# Altium project OnkoV1.PrjPCB
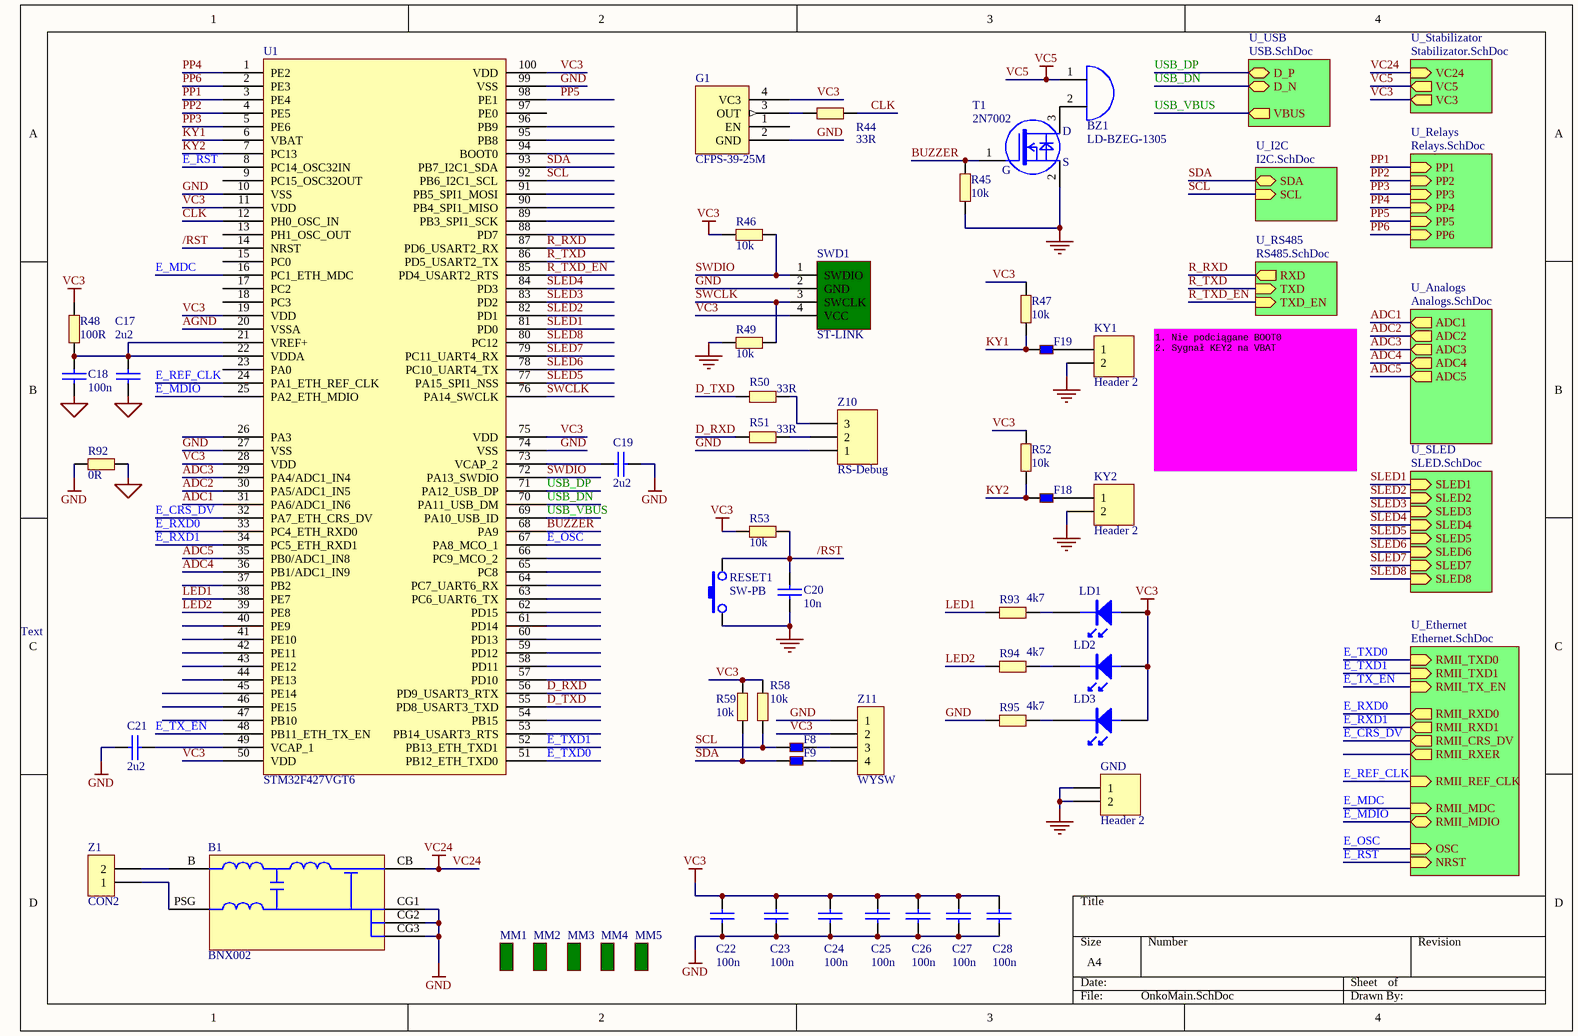
[diagram p0: OnkoMain.SchDoc]
9 sheets, 231 parts. Net scope: hierarchical (ports join the sheet entries above them; power ports are global).
Board file: OnkoV1.PcbDoc
Sheets:
  OnkoMain.SchDoc
    U_Analogs = Analogs.SchDoc
    U_Stabilizator = Stabilizator.SchDoc
    U_Relays = Relays.SchDoc
    U_Ethernet = Ethernet.SchDoc
    U_USB = USB.SchDoc
    U_I2C = I2C.SchDoc
    U_SLED = SLED.SchDoc
    U_RS485 = RS485.SchDoc

## Sheet OnkoMain.SchDoc
size A4

### Parts
B1  BNX002  [BNX002]
BZ1  LD-BZEG-1305  [LD-BZEG-1305]
C17  2u2  [0805C]
C18  100n  [0805C]
C19  2u2  [0805C]
C20  10n  [0805C]
C21  2u2  [0805C]
C22  100n  [0805C]
C23  100n  [0805C]
C24  100n  [0805C]
C25  100n  [0805C]
C26  100n  [0805C]
C27  100n  [0805C]
C28  100n  [0805C]
F8  BLM18BB141SN1D  [0805L]  (value not drawn)
F9  BLM18BB141SN1D  [0805L]  (value not drawn)
F18  BLM18BB141SN1D  [0805L]  (value not drawn)
F19  BLM18BB141SN1D  [0805L]  (value not drawn)
G1  CFPS-39-25M  [GEN_SMD1_1]
GND  Header 2  [HDR1X2]
KY1  Header 2  [HDR1X2]
KY2  Header 2  [HDR1X2]
LD1  (no value)  [0805LG]
LD2  (no value)  [0805LR]
LD3  (no value)  [0805LG]
MM1  (no value)  [REF_CIR]
MM2  (no value)  [REF_CIR]
MM3  (no value)  [REF_SQR]
MM4  (no value)  [REF_SQR]
MM5  (no value)  [PB_FREE_GRAF]
R44  33R  [0805R]
R45  10k  [0805]
R46  10k  [0805R]
R47  10k  [0805R]
R48  100R  [0805]
R49  10k  [0805R]
R50  33R  [0805R]
R51  33R  [0805R]
R52  10k  [0805R]
R53  10k  [0805R]
R58  10k  [0805R]
R59  10k  [0805R]
R92  0R  [0805]
R93  4k7  [0805R]
R94  4k7  [0805R]
R95  4k7  [0805R]
RESET1  SW-PB  [DTSM31N_2]
SWD1  ST-LINK  [PIN4]
T1  2N7002  [SOT23]
U1  STM32F427VGT6  [VQ100_2]
Z1  CON2  [ARC-L-2-5.08]
Z10  RS-Debug  [PIN3]
Z11  WYSW  [PIN4]

### Sub-sheets
U_Analogs = Analogs.SchDoc: ADC1 (out), ADC2 (out), ADC3 (out), ADC4 (out), ADC5 (out)
U_Ethernet = Ethernet.SchDoc: RMII_TXD0 (in), RMII_TX_EN (in), RMII_RXD0 (out), RMII_REF_CLK (in), RMII_CRS_DV (out), RMII_MDC (in), RMII_MDIO (bidir), NRST (in), RMII_TXD1 (in), RMII_RXD1 (out), RMII_RXER (out), OSC (in)
U_I2C = I2C.SchDoc: SCL (in), SDA (bidir)
U_Relays = Relays.SchDoc: PP1 (in), PP2 (in), PP3 (in), PP4 (in), PP5 (in), PP6 (in)
U_RS485 = RS485.SchDoc: TXD (in), TXD_EN (in), RXD (out)
U_SLED = SLED.SchDoc: SLED1 (in), SLED2 (in), SLED3 (in), SLED4 (in), SLED5 (in), SLED6 (in), SLED7 (in), SLED8 (in)
U_Stabilizator = Stabilizator.SchDoc: VC5 (out), VC3 (out), VC24 (in)
U_USB = USB.SchDoc: D_N (bidir), D_P (bidir), VBUS (out)

### Nets
AGND: C17.2 C18.2 R92.1 U1.20(VSSA)
GND: B1.CG1 B1.CG2 B1.CG3 C19.1 C20.2 C21.1 C22.2 C23.2 C24.2 C25.2 C26.2 C27.2 C28.2 G1.2(GND) GND.1 GND.2 KY1.2 KY2.2 R45.2 R49.1 R92.2 R95.2 RESET1.1 SWD1.2(GND) T1.2(S) U1.10(VSS) U1.27(VSS) U1.74(VSS) U1.99(VSS) Z10.1 Z11.1
VC3: C22.1 C23.1 C24.1 C25.1 C26.1 C27.1 C28.1 G1.4(VC3) LD1.A LD2.A LD3.A R46.1 R47.2 R48.2 R52.2 R53.1 R58.2 R59.2 SWD1.4(VCC) U1.11(VDD) U1.19(VDD) U1.28(VDD) U1.50(VDD) U1.75(VDD) U1.100(VDD) Z11.2 ; sheet U_Stabilizator/VC3
VC5: BZ1.1 ; sheet U_Stabilizator/VC5
VC24: B1.CB ; sheet U_Stabilizator/VC24
/RST: C20.1 R53.2 RESET1.2 U1.14(NRST)
ADC1: U1.31(PA6/ADC1_IN6) ; sheet U_Analogs/ADC1
ADC2: U1.30(PA5/ADC1_IN5) ; sheet U_Analogs/ADC2
ADC3: U1.29(PA4/ADC1_IN4) ; sheet U_Analogs/ADC3
ADC4: U1.36(PB1/ADC1_IN9) ; sheet U_Analogs/ADC4
ADC5: U1.35(PB0/ADC1_IN8) ; sheet U_Analogs/ADC5
BUZZER: R45.1 T1.1 U1.68(PA9)
CLK: R44.2 U1.12(PH0_OSC_IN)
D_RXD: R51.2 U1.56(PD9_USART3_RTX)
D_TXD: R50.2 U1.55(PD8_USART3_TXD)
E_CRS_DV: U1.32(PA7_ETH_CRS_DV) ; sheet U_Ethernet/RMII_CRS_DV
E_MDC: U1.16(PC1_ETH_MDC) ; sheet U_Ethernet/RMII_MDC
E_MDIO: U1.25(PA2_ETH_MDIO) ; sheet U_Ethernet/RMII_MDIO
E_OSC: U1.67(PA8_MCO_1) ; sheet U_Ethernet/OSC
E_REF_CLK: U1.24(PA1_ETH_REF_CLK) ; sheet U_Ethernet/RMII_REF_CLK
E_RST: U1.8(PC14_OSC32IN) ; sheet U_Ethernet/NRST
E_RXD0: U1.33(PC4_ETH_RXD0) ; sheet U_Ethernet/RMII_RXD0
E_RXD1: U1.34(PC5_ETH_RXD1) ; sheet U_Ethernet/RMII_RXD1
E_TX_EN: U1.48(PB11_ETH_TX_EN) ; sheet U_Ethernet/RMII_TX_EN
E_TXD0: U1.51(PB12_ETH_TXD0) ; sheet U_Ethernet/RMII_TXD0
E_TXD1: U1.52(PB13_ETH_TXD1) ; sheet U_Ethernet/RMII_TXD1
KY1: F19.2 R47.1 U1.6(VBAT)
KY2: F18.2 R52.1 U1.7(PC13)
LED1: R93.2 U1.38(PE7)
LED2: R94.2 U1.39(PE8)
PP1: U1.3(PE4) ; sheet U_Relays/PP1
PP2: U1.4(PE5) ; sheet U_Relays/PP2
PP3: U1.5(PE6) ; sheet U_Relays/PP3
PP4: U1.1(PE2) ; sheet U_Relays/PP4
PP5: U1.98(PE1) ; sheet U_Relays/PP5
PP6: U1.2(PE3) ; sheet U_Relays/PP6
R_RXD: U1.87(PD6_USART2_RX) ; sheet U_RS485/RXD
R_TXD: U1.86(PD5_USART2_TX) ; sheet U_RS485/TXD
R_TXD_EN: U1.85(PD4_USART2_RTS) ; sheet U_RS485/TXD_EN
SCL: F8.2 R58.1 U1.92(PB6_I2C1_SCL) ; sheet U_I2C/SCL
SDA: F9.2 R59.1 U1.93(PB7_I2C1_SDA) ; sheet U_I2C/SDA
SLED1: U1.81(PD0) ; sheet U_SLED/SLED1
SLED2: U1.82(PD1) ; sheet U_SLED/SLED2
SLED3: U1.83(PD2) ; sheet U_SLED/SLED3
SLED4: U1.84(PD3) ; sheet U_SLED/SLED4
SLED5: U1.77(PA15_SPI1_NSS) ; sheet U_SLED/SLED5
SLED6: U1.78(PC10_UART4_TX) ; sheet U_SLED/SLED6
SLED7: U1.79(PC11_UART4_RX) ; sheet U_SLED/SLED7
SLED8: U1.80(PC12) ; sheet U_SLED/SLED8
SWCLK: R49.2 SWD1.3(SWCLK) U1.76(PA14_SWCLK)
SWDIO: R46.2 SWD1.1(SWDIO) U1.72(PA13_SWDIO)
USB_DN: U1.70(PA11_USB_DM) ; sheet U_USB/D_N
USB_DP: U1.71(PA12_USB_DP) ; sheet U_USB/D_P
USB_VBUS: U1.69(PA10_USB_ID) ; sheet U_USB/VBUS
NetB1_B: B1.B Z1.2
NetB1_PSG: B1.PSG Z1.1
NetBZ1_2: BZ1.2 T1.3(D)
NetC17_1: C17.1 C18.1 R48.1 U1.21(VREF+) U1.22(VDDA)
NetC19_2: C19.2 U1.73(VCAP_2)
NetC21_2: C21.2 U1.49(VCAP_1)
NetF8_1: F8.1 Z11.3
NetF9_1: F9.1 Z11.4
NetF18_1: F18.1 KY2.1
NetF19_1: F19.1 KY1.1
NetG1_3: G1.3(OUT) R44.1
NetLD1_K: LD1.K R93.1
NetLD2_K: LD2.K R94.1
NetLD3_K: LD3.K R95.1
NetR50_1: R50.1 Z10.3
NetR51_1: R51.1 Z10.2

Not connected (* = marked no-connect by the designer): G1 1(EN); U1 9(PC15_OSC32OUT) 13(PH1_OSC_OUT) 15(PC0) 17(PC2) 18(PC3) 23(PA0) 26(PA3) 37(PB2) 40(PE9) 41(PE10) 42(PE11) 43(PE12) 44(PE13) 45(PE14) 46(PE15) 47(PB10) 53(PB14_USART3_RTS) 54(PB15) 57(PD10) 58(PD11) 59(PD12) 60(PD13) 61(PD14) 62(PD15) 63(PC6_UART6_TX) 64(PC7_UART6_RX) 65(PC8) 66(PC9_MCO_2) 88(PD7) 89(PB3_SPI1_SCK) 90(PB4_SPI1_MISO) 91(PB5_SPI1_MOSI) 94(BOOT0) 95(PB8) 96(PB9) 97(PE0)

### Notes on the sheet
- 1. Nie podciągane BOOT0
  2. Sygnał KEY2 na VBAT
- Text
- (in symbol MOSFET-P_1_1) G

### Library data of the parts
BZ1 = BUZZER
C17-C28 = CAP: Capacitor
F8 F9 F18 F19 = KORALIK: Koralik ferrytowy
G1 = GENER_SMD
GND KY1 KY2 = Header 2: Header, 2-Pin; LatestRevisionDate: 17-Jul-2002; LatestRevisionNote: Re-released for DXP Platform.; Publisher: Altium Limited
LD1-LD3 = LED
MM1-MM5 = MECH
R44-R53 R58 R59 R92-R95 = RES3
SWD1 = SW_CON: Header, 4-Pin; LatestRevisionDate: 17-Jul-2002; LatestRevisionNote: Re-released for DXP Platform.; Publisher: Altium Limited
T1 = MOSFET-P_1_1
U1 = STM32F427_LQFP100
Z1 = CON2: Connector
Z10 = Header 3: Header, 3-Pin; LatestRevisionDate: 17-Jul-2002; LatestRevisionNote: Re-released for DXP Platform.; Publisher: Altium Limited
Z11 = CON4: Connector

## Sheet Analogs.SchDoc
size A4
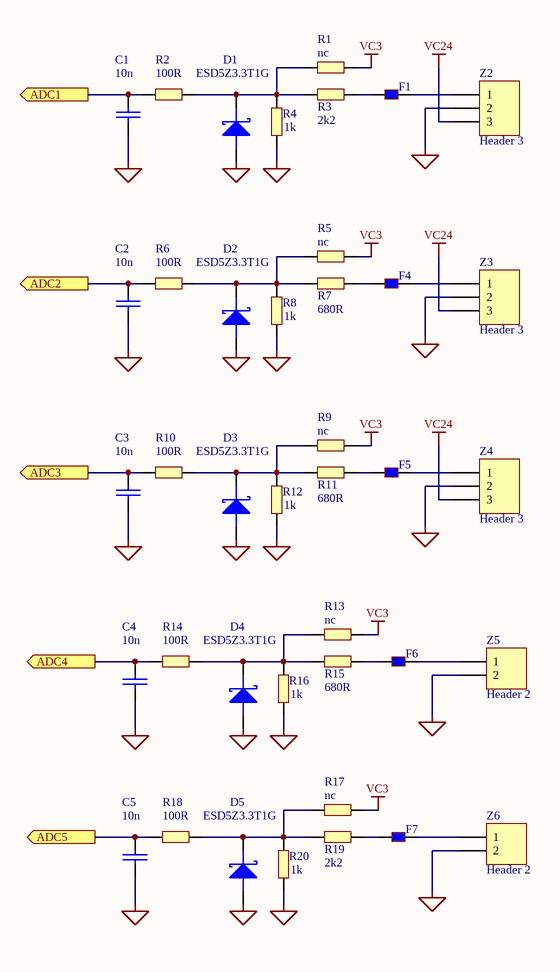
[diagram p1: Analogs.SchDoc]

### Parts
C1  10n  [0805C]
C2  10n  [0805C]
C3  10n  [0805C]
C4  10n  [0805C]
C5  10n  [0805C]
D1  ESD5Z3.3T1G  [SOD_523]
D2  ESD5Z3.3T1G  [SOD_523]
D3  ESD5Z3.3T1G  [SOD_523]
D4  ESD5Z3.3T1G  [SOD_523]
D5  ESD5Z3.3T1G  [SOD_523]
F1  BLM18BB141SN1D  [0805L]  (value not drawn)
F4  BLM18BB141SN1D  [0805L]  (value not drawn)
F5  BLM18BB141SN1D  [0805L]  (value not drawn)
F6  BLM18BB141SN1D  [0805L]  (value not drawn)
F7  BLM18BB141SN1D  [0805L]  (value not drawn)
R1  nc  [0805R]
R2  100R  [0805R]
R3  2k2  [0805R]
R4  1k  [0805R]
R5  nc  [0805R]
R6  100R  [0805R]
R7  680R  [0805R]
R8  1k  [0805R]
R9  nc  [0805R]
R10  100R  [0805R]
R11  680R  [0805R]
R12  1k  [0805R]
R13  nc  [0805R]
R14  100R  [0805R]
R15  680R  [0805R]
R16  1k  [0805R]
R17  nc  [0805R]
R18  100R  [0805R]
R19  2k2  [0805R]
R20  1k  [0805R]
Z2  Header 3  [ARC-L-3-3.5]
Z3  Header 3  [ARC-L-3-3.5]
Z4  Header 3  [ARC-L-3-3.5]
Z5  Header 2  [ARC-L-2-3.5]
Z6  Header 2  [ARC-L-2-3.5]

### Ports
ADC1 (out), ADC2 (out), ADC3 (out), ADC4 (out), ADC5 (out)

### Nets
AGND: C1.2 C2.2 C3.2 C4.2 C5.2 D1.A D2.A D3.A D4.A D5.A R4.1 R8.1 R12.1 R16.1 R20.1 Z2.2 Z3.2 Z4.2 Z5.2 Z6.2
VC3: R1.1 R5.1 R9.1 R13.1 R17.1
VC24: Z2.3 Z3.3 Z4.3
ADC1: C1.1 R2.1 ; port ADC1
ADC2: C2.1 R6.1 ; port ADC2
ADC3: C3.1 R10.1 ; port ADC3
ADC4: C4.1 R14.1 ; port ADC4
ADC5: C5.1 R18.1 ; port ADC5
NetD1_K: D1.K R1.2 R2.2 R3.2 R4.2
NetD2_K: D2.K R5.2 R6.2 R7.2 R8.2
NetD3_K: D3.K R9.2 R10.2 R11.2 R12.2
NetD4_K: D4.K R13.2 R14.2 R15.2 R16.2
NetD5_K: D5.K R17.2 R18.2 R19.2 R20.2
NetF1_1: F1.1 Z2.1
NetF1_2: F1.2 R3.1
NetF4_1: F4.1 Z3.1
NetF4_2: F4.2 R7.1
NetF5_1: F5.1 Z4.1
NetF5_2: F5.2 R11.1
NetF6_1: F6.1 Z5.1
NetF6_2: F6.2 R15.1
NetF7_1: F7.1 Z6.1
NetF7_2: F7.2 R19.1

### Library data of the parts
C1-C5 = CAP: Capacitor
D1-D5 = DIODE SCHOTTKY
F1 F4-F7 = KORALIK: Koralik ferrytowy
R1-R20 = RES3
Z2-Z4 = Header 3: Header, 3-Pin; LatestRevisionDate: 17-Jul-2002; LatestRevisionNote: Re-released for DXP Platform.; Publisher: Altium Limited
Z5 Z6 = Header 2: Header, 2-Pin; LatestRevisionDate: 17-Jul-2002; LatestRevisionNote: Re-released for DXP Platform.; Publisher: Altium Limited

## Sheet Stabilizator.SchDoc
size A4
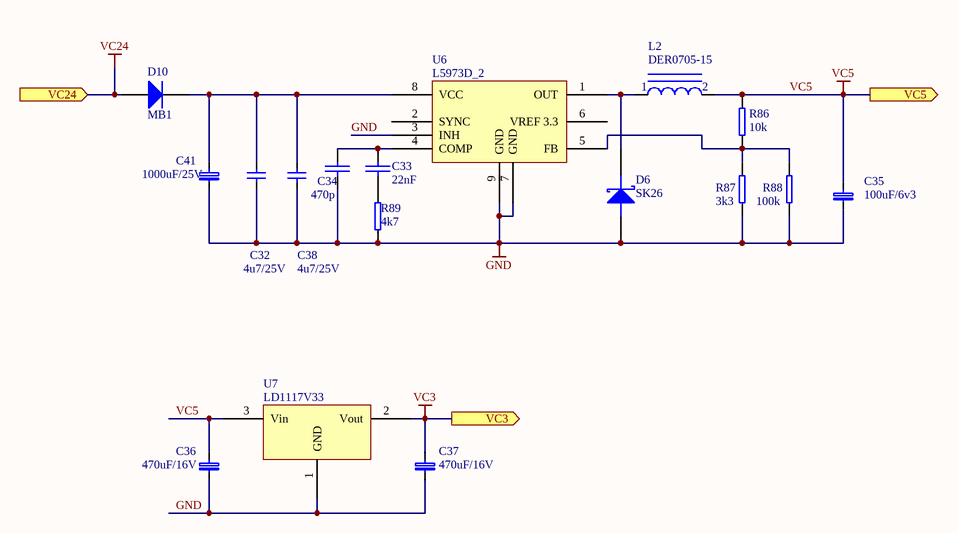
[diagram p2: Stabilizator.SchDoc]

### Parts
C32  4u7/25V  [1206]
C33  22nF  [0805C]
C34  470p  [0805C]
C35  100uF/6v3  [CAP_C]
C36  470uF/16V  [RB-.15/.30]
C37  470uF/16V  [RB-.15/.30]
C38  4u7/25V  [1206]
C41  1000uF/25V  [RB-.2/.4]
D6  SK26  [RD5]
D10  MB1  [SMB]
L2  DER0705-15  [DER0705_1]
R86  10k  [0805R]
R87  3k3  [0805R]
R88  100k  [0805R]
R89  4k7  [0805R]
U6  L5973D_2  [SO8_M]
U7  LD1117V33  [DPAK]

### Ports
VC3 (out), VC5 (out), VC24 (in)

### Nets
GND: C32.1 C34.2 C35.1 C36.1 C37.1 C38.1 C41.1 D6.A R87.2 R88.2 R89.2 U6.3(INH) U6.7(GND) U6.9(GND) U7.1(GND)
VC3: C37.2 U7.2(Vout) ; port VC3
VC5: C35.2 C36.2 L2.2 R86.1 U7.3(Vin) ; port VC5
VC24: D10.A ; port VC24
NetC32_2: C32.2 C38.2 C41.2 D10.K U6.8(VCC)
NetC33_1: C33.1 R89.1
NetC33_2: C33.2 C34.1 U6.4(COMP)
NetD6_K: D6.K L2.1 U6.1(OUT)
NetR86_2: R86.2 R87.1 R88.1 U6.5(FB)

Not connected (* = marked no-connect by the designer): U6 2(SYNC) 6(VREF_3.3)

### Library data of the parts
C32 C38 = CAP
C33 C34 = CAP: Capacitor
C35-C37 C41 = CAP_TANTAL_SMD: KONDENSATOR ELEKTROLITYCZNY TANTALOWY SMD
D6 = DIODE SCHOTTKY: Schottky Diode
D10 = Diode: Default Diode; Published: 8-Jun-2000; LatestRevisionDate: 17-Jul-2002; LatestRevisionNote: Re-released for DXP Platform.; PackageVersion: Sep-1996; PackageReference: SMC; Publisher: Altium Limited; PackageDescription: DO-214-AB/SMC; 2 C-Bend Leads; Body 7.9 x 5.9 mm, inc. leads (LxW); Code_JEDEC: DO-214-AB
L2 = CEWKA_1
R86-R89 = RES3

## Sheet Relays.SchDoc
size A4
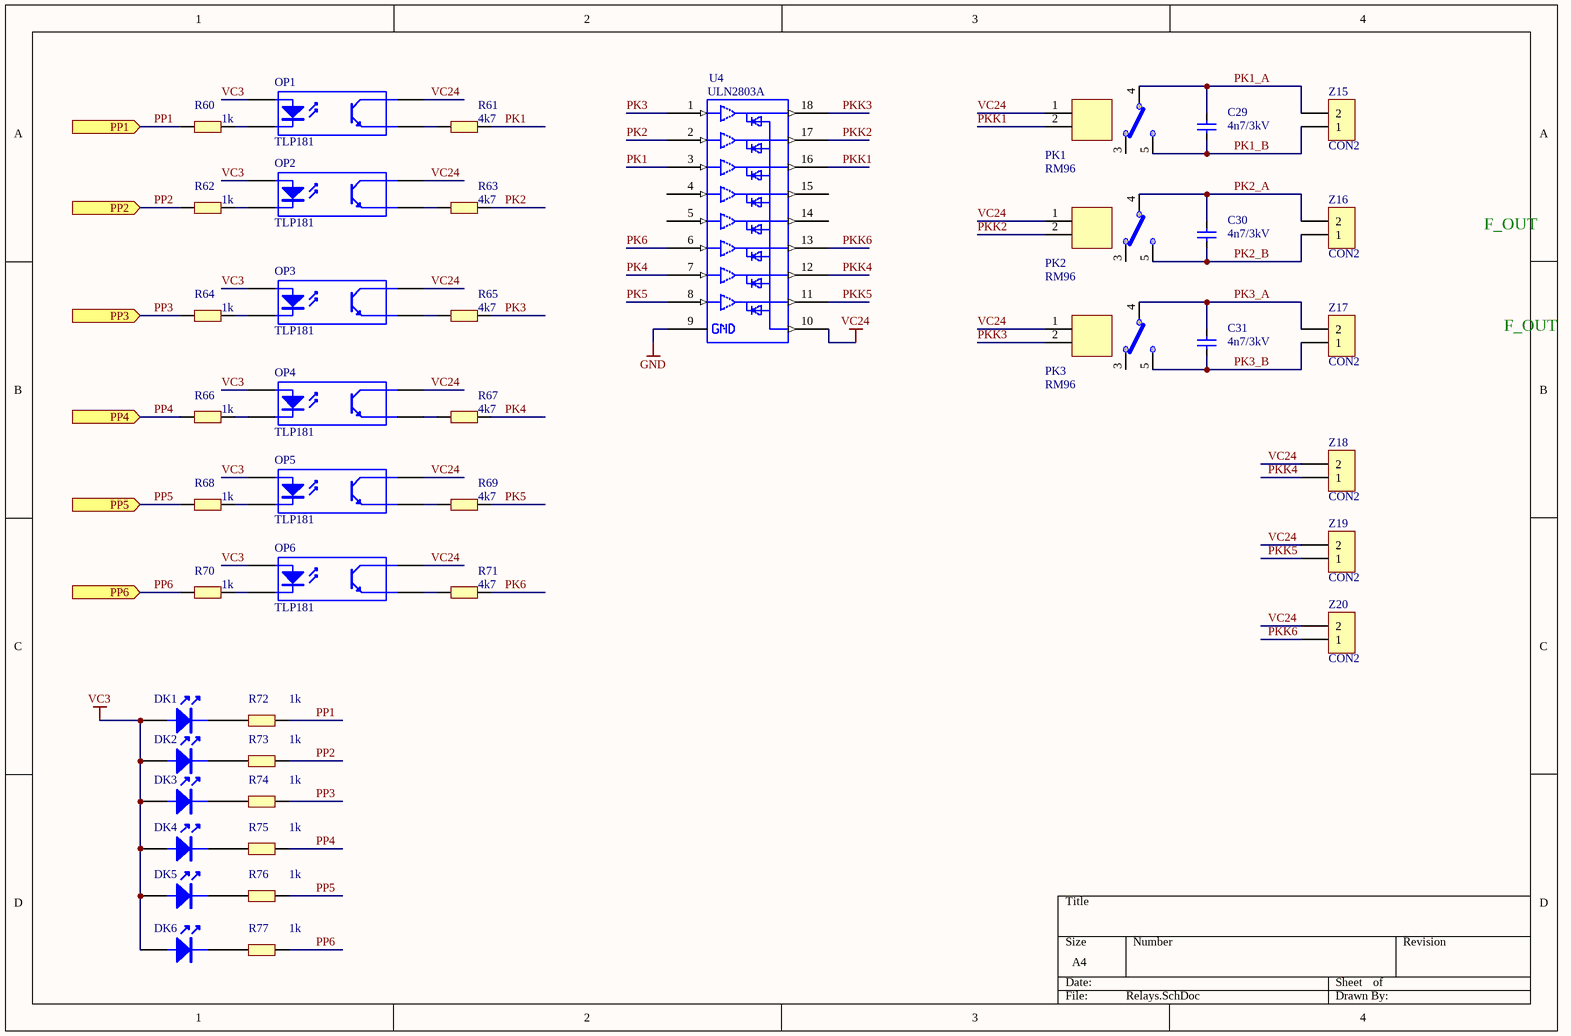
[diagram p3: Relays.SchDoc]

### Parts
C29  4n7/3kV  [CAP_75]
C30  4n7/3kV  [CAP_75]
C31  4n7/3kV  [CAP_75]
DK1  (no value)  [0805LR]
DK2  (no value)  [0805LR]
DK3  (no value)  [0805LR]
DK4  (no value)  [0805LR]
DK5  (no value)  [0805LR]
DK6  (no value)  [0805LR]
OP1  TLP181  [TLP181_1]
OP2  TLP181  [TLP181_1]
OP3  TLP181  [TLP181_1]
OP4  TLP181  [TLP181_1]
OP5  TLP181  [TLP181_1]
OP6  TLP181  [TLP181_1]
PK1  RM96  [RM96A]
PK2  RM96  [RM96A]
PK3  RM96  [RM96A]
R60  1k  [0805R]
R61  4k7  [0805R]
R62  1k  [0805R]
R63  4k7  [0805R]
R64  1k  [0805R]
R65  4k7  [0805R]
R66  1k  [0805R]
R67  4k7  [0805R]
R68  1k  [0805R]
R69  4k7  [0805R]
R70  1k  [0805R]
R71  4k7  [0805R]
R72  1k  [0805R]
R73  1k  [0805R]
R74  1k  [0805R]
R75  1k  [0805R]
R76  1k  [0805R]
R77  1k  [0805R]
U4  ULN2803A  [SO-18]
Z15  CON2  [ARC-L-2-5.08]
Z16  CON2  [ARC-L-2-5.08]
Z17  CON2  [ARC-L-2-5.08]
Z18  CON2  [ARC-L-2-5.08]
Z19  CON2  [ARC-L-2-5.08]
Z20  CON2  [ARC-L-2-5.08]

### Ports
PP1 (in), PP2 (in), PP3 (in), PP4 (in), PP5 (in), PP6 (in)

### Nets
GND: U4.9
VC3: DK1.A DK2.A DK3.A DK4.A DK5.A DK6.A OP1.1 OP2.1 OP3.1 OP4.1 OP5.1 OP6.1
VC24: OP1.4 OP2.4 OP3.4 OP4.4 OP5.4 OP6.4 PK1.1 PK2.1 PK3.1 U4.10 Z18.2 Z19.2 Z20.2
PK1: R61.2 U4.3
PK1_A: C29.2 PK1.4 Z15.2
PK1_B: C29.1 PK1.5 Z15.1
PK2: R63.2 U4.2
PK2_A: C30.2 PK2.4 Z16.2
PK2_B: C30.1 PK2.5 Z16.1
PK3: R65.2 U4.1
PK3_A: C31.2 PK3.4 Z17.2
PK3_B: C31.1 PK3.5 Z17.1
PK4: R67.2 U4.7
PK5: R69.2 U4.8
PK6: R71.2 U4.6
PKK1: PK1.2 U4.16
PKK2: PK2.2 U4.17
PKK3: PK3.2 U4.18
PKK4: U4.12 Z18.1
PKK5: U4.11 Z19.1
PKK6: U4.13 Z20.1
PP1: R60.1 R72.2 ; port PP1
PP2: R62.1 R73.2 ; port PP2
PP3: R64.1 R74.2 ; port PP3
PP4: R66.1 R75.2 ; port PP4
PP5: R68.1 R76.2 ; port PP5
PP6: R70.1 R77.2 ; port PP6
NetDK1_K: DK1.K R72.1
NetDK2_K: DK2.K R73.1
NetDK3_K: DK3.K R74.1
NetDK4_K: DK4.K R75.1
NetDK5_K: DK5.K R76.1
NetDK6_K: DK6.K R77.1
NetOP1_2: OP1.2 R60.2
NetOP1_3: OP1.3 R61.1
NetOP2_2: OP2.2 R62.2
NetOP2_3: OP2.3 R63.1
NetOP3_2: OP3.2 R64.2
NetOP3_3: OP3.3 R65.1
NetOP4_2: OP4.2 R66.2
NetOP4_3: OP4.3 R67.1
NetOP5_2: OP5.2 R68.2
NetOP5_3: OP5.3 R69.1
NetOP6_2: OP6.2 R70.2
NetOP6_3: OP6.3 R71.1

Not connected (* = marked no-connect by the designer): PK1 3; PK2 3; PK3 3; U4 4 5 14 15

### Notes on the sheet
- F_OUT

### Library data of the parts
C29-C31 = CAP
DK1-DK6 = LED
OP1-OP6 = TLP621: Optoisolator
R60-R77 = RES3
U4 = Pro31.tmp_ULN2803A_42
Z15-Z20 = CON2: Connector

## Sheet Ethernet.SchDoc
size A4
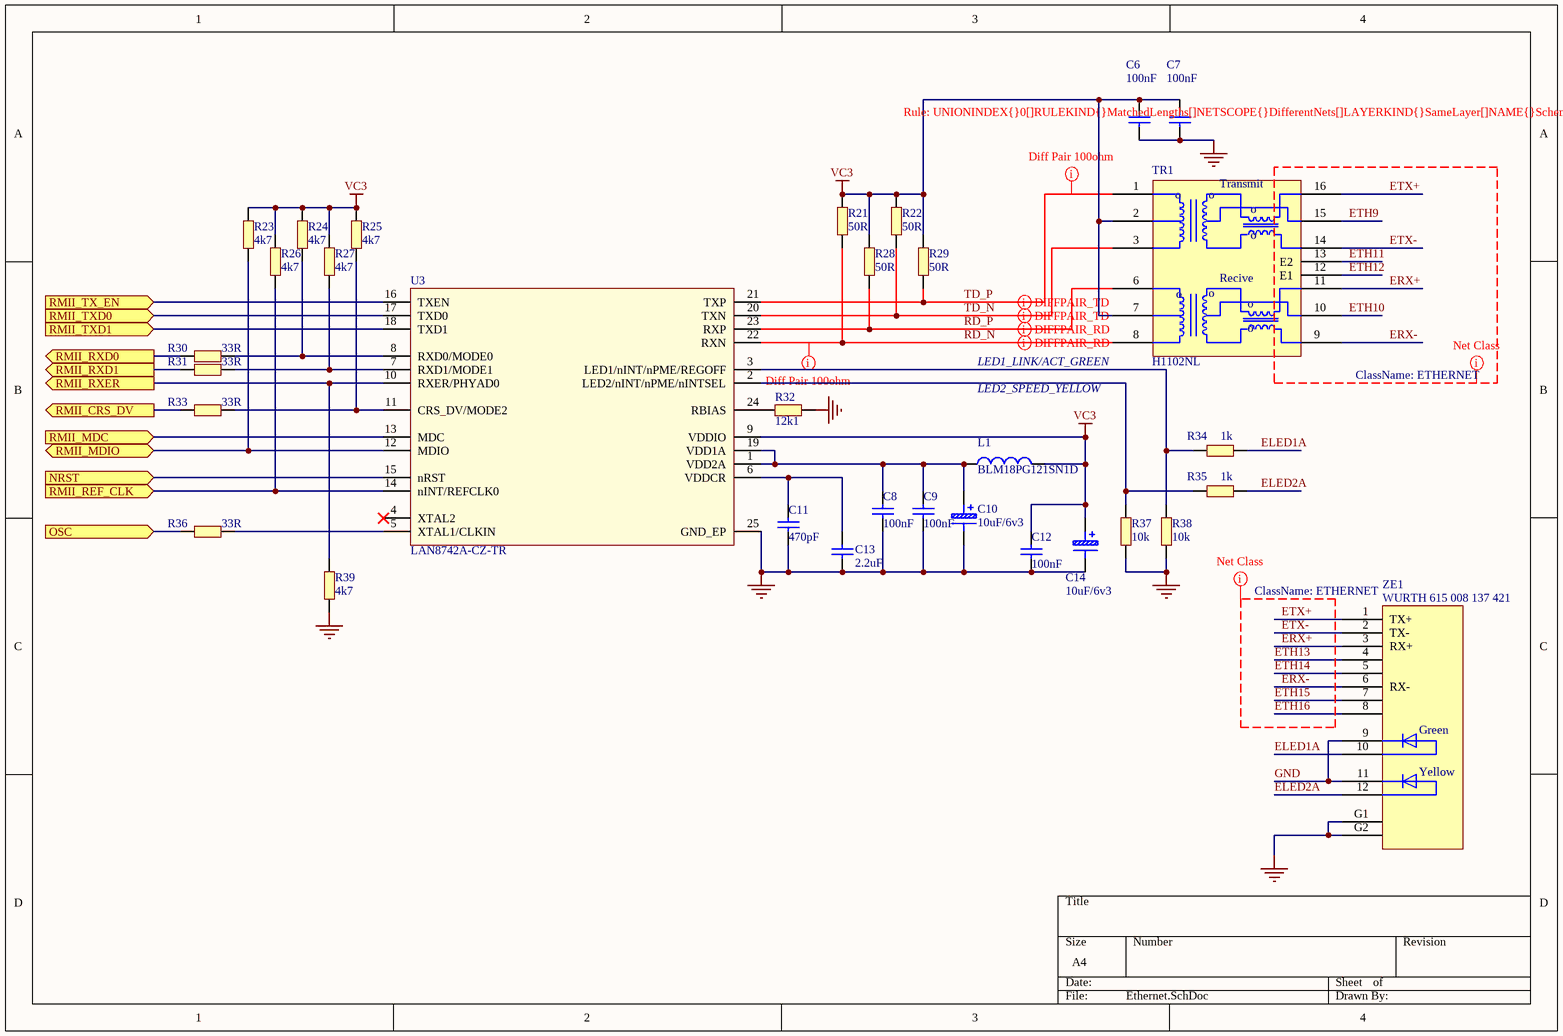
[diagram p4: Ethernet.SchDoc]

### Parts
C6  100nF  [0805C]
C7  100nF  [0805C]
C8  100nF  [0805C]
C9  100nF  [0805C]
C10  10uF/6v3  [CAP_A]
C11  470pF  [0805C]
C12  100nF  [0805C]
C13  2.2uF  [0805C]
C14  10uF/6v3  [CAP_A]
L1  BLM18PG121SN1D  [0805]
R21  50R  [0805R]
R22  50R  [0805R]
R23  4k7  [0805R]
R24  4k7  [0805R]
R25  4k7  [0805R]
R26  4k7  [0805R]
R27  4k7  [0805R]
R28  50R  [0805R]
R29  50R  [0805R]
R30  33R  [0805R]
R31  33R  [0805R]
R32  12k1  [0805R]
R33  33R  [0805R]
R34  1k  [0805R]
R35  1k  [0805R]
R36  33R  [0805R]
R37  10k  [0805R]
R38  10k  [0805R]
R39  4k7  [0805R]
TR1  H1102NL  [H1102]
U3  LAN8742A-CZ-TR  [QFN24_LAN]
ZE1  WURTH 615 008 137 421  [RJ45GELED]

### Ports
NRST (in), OSC (in), RMII_CRS_DV (out), RMII_MDC (in), RMII_MDIO (bidir), RMII_REF_CLK (in), RMII_RXD0 (out), RMII_RXD1 (out), RMII_RXER (out), RMII_TX_EN (in), RMII_TXD0 (in), RMII_TXD1 (in)

### Nets
GND: C6.1 C7.1 C8.1 C9.1 C10.1 C11.1 C12.1 C13.1 C14.1 R32.1 R37.1 R38.1 R39.1 U3.25(GND_EP) ZE1.9 ZE1.11 ZE1.G1 ZE1.G2
VC3: C6.2 C7.2 C12.2 C14.2 L1.2 R21.2 R22.2 R23.2 R24.2 R25.2 R26.2 R27.2 R28.2 R29.2 TR1.2(TI2) TR1.7(RI2) U3.9(VDDIO)
E_CRS_DV: R33.1 ; port RMII_CRS_DV
E_MDC: U3.13(MDC) ; port RMII_MDC
E_MDIO: R23.1 U3.12(MDIO) ; port RMII_MDIO
E_OSC: R36.1 ; port OSC
E_REF_CLK: R26.1 U3.14(nINT/REFCLK0) ; port RMII_REF_CLK
E_RST: U3.15(nRST) ; port NRST
E_RXD0: R30.1 ; port RMII_RXD0
E_RXD1: R31.1 ; port RMII_RXD1
E_TX_EN: U3.16(TXEN) ; port RMII_TX_EN
E_TXD0: U3.17(TXD0) ; port RMII_TXD0
E_TXD1: U3.18(TXD1) ; port RMII_TXD1
ELED1A: R34.1 ZE1.10
ELED2A: R35.1 ZE1.12
ERX+: TR1.11(RO1) ZE1.3(RX+)
ERX-: TR1.9(RO2) ZE1.6(RX-)
ETH9: TR1.15
ETH10: TR1.10
ETH11: TR1.13(E2)
ETH12: TR1.12(E1)
ETH13: ZE1.4
ETH14: ZE1.5
ETH15: ZE1.7
ETH16: ZE1.8
ETX+: TR1.16(TO1) ZE1.1(TX+)
ETX-: TR1.14(TO2) ZE1.2(TX-)
RD_N: R21.1 TR1.8(RI3) U3.22(RXN)
RD_P: R28.1 TR1.6(RI1) U3.23(RXP)
TD_N: R22.1 TR1.3(TI3) U3.20(TXN)
TD_P: R29.1 TR1.1(TI1) U3.21(TXP)
NetC8_2: C8.2 C9.2 C10.2 L1.1 U3.1(VDD2A) U3.19(VDD1A)
NetC11_2: C11.2 C13.2 U3.6(VDDCR)
NetR24_1: R24.1 R30.2 U3.8(RXD0/MODE0)
NetR25_1: R25.1 R33.2 U3.11(CRS_DV/MODE2)
NetR27_1: R27.1 R31.2 U3.7(RXD1/MODE1)
NetR32_2: R32.2 U3.24(RBIAS)
NetR34_2: R34.2 R38.2 U3.3(LED1/nINT/nPME/REGOFF)
NetR35_2: R35.2 R37.2 U3.2(LED2/nINT/nPME/nINTSEL)
NetR36_2: R36.2 U3.5(XTAL1/CLKIN)
NetR39_2: R39.2 U3.10(RXER/PHYAD0) ; port RMII_RXER

Not connected (* = marked no-connect by the designer): U3 4(XTAL2)*

### Layout directives
differential pair: RD_N, RD_P, TD_N, TD_P
rule Matched Net Lengths [Tolerance = 300mil]: RD_N, TD_P
net class ETHERNET: ERX+, ERX-, ETH9, ETH10, ETH11, ETH12, ETH13, ETH14, ETH15, ETH16, ETX+, ETX-

### Notes on the sheet
- LED1_LINK/ACT_GREEN
- LED2_SPEED_YELLOW
- (in symbol H1102NL) Transmit; o; Recive
- (in symbol RJ45GELED) Green; Yellow

### Library data of the parts
C6-C9 C12 = Cap_100nF_X7R_10%_0402: Capacitor,100nF,16V,X7R,10%,0402,YAGEO; Manuf_Part_1: CC0402KRX7R7BB104; Revision: July-2002: Re-released for DXP Platform.; Value: 100nF; Order: CC0402KRX7R7BB104; Manuf_1: YAGEO
C10 C14 = CapTantal
C11 = Cap_470pF_X7R_10%_0402: Capacitor,470pF,16V,X7R,10%,0402,YAGEO; Manuf_Part_1: 0402YC471KAT4A; Revision: July-2002: Re-released for DXP Platform.; Value: 470pF; Order: 0402YC471KAT4A; Manuf_1: YAGEO; ECCN_US/EU: n/a
C13 = Cap_1uF_X5R_10%_0603: Capacitor,1uF,16V,X5R,10%,0603,YAGEO; Manuf_Part_1: CC0603KRX5R7BB105; Revision: July-2002: Re-released for DXP Platform.; Value: 1uF; Order: CC0603KRX5R7BB105; Manuf_1: YAGEO; ECCN_US/EU: n/a
L1 = BEAD_120R_2A_0603: Bead,120R,2A,0603,BLM18PG121SN1D,MURATA; Manuf_Part_3: FCM1608KF-601T03; Manuf_2: TDK; Manuf_Part_2: MPZ1608S300A; Manuf_3: Tai-tech; Value: 100uH; Description_3: Bead,600R,350mA,0603,FCM1608KF-601T03,Tai-tech; Description_2: Bead,30R,5A,0603,MPZ1608S300A,TDK; Revision: July-2002: Re-released for DXP Platform.; ECCN_US/EU: n/a; Manuf_Part_1: BLM18PG121SN1D; Manuf_1: MURATA
R21-R39 = RES3
TR1 = H1102NL: Dostawca.Symbol: 749010310; Dostawca: WURTH
U3 = LAN8742A-CZ-TR: LAN8742A-CZ-TR - Small Footprint RMII 10/100 Ethernet, Transceiver with HP Auto-MDIX and flexPWR Technology SQFN-24; Manuf_1: MICROCHIP; Dostawca.Symbol: 579-LAN8742A-CZ; Dostawca: Mouser; Order: LAN8742A-CZ-TR; Manuf_Part_1: LAN8742A-CZ-TR; Distrib: MICROCHIP
ZE1 = RJ45GELED

## Sheet USB.SchDoc
size A4
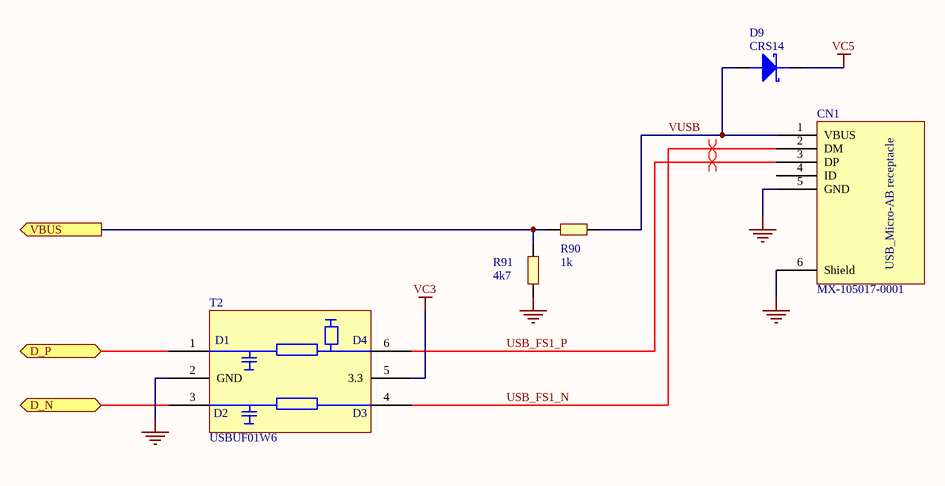
[diagram p5: USB.SchDoc]

### Parts
CN1  MX-105017-0001  [MOLEX_MICROUSB_MX-105017-0001]
D9  CRS14  [1206D]
R90  1k  [0805R]
R91  4k7  [0805R]
T2  USBUF01W6  [SOTT323-6L]

### Ports
D_N (bidir), D_P (bidir), VBUS (out)

### Nets
GND: CN1.5(GND) CN1.6(Shield) R91.2 T2.2(GND)
VC3: T2.5(3.3)
VC5: D9.K
USB_DN: T2.3(D2) ; port D_N
USB_DP: T2.1(D1) ; port D_P
USB_FS1_N: CN1.2(DM) T2.4(D3)
USB_FS1_P: CN1.3(DP) T2.6(D4)
USB_VBUS: R90.2 R91.1 ; port VBUS
VUSB: CN1.1(VBUS) D9.A R90.1

Not connected (* = marked no-connect by the designer): CN1 4(ID)

### Layout directives
differential pair: USB_FS1_N, USB_FS1_P

### Notes on the sheet
- (in symbol USB-MICRO-AB) USB_Micro-AB receptacle

### Library data of the parts
CN1 = USB-MICRO-AB: Manuf_1: MOLEX; Manuf_Part_1: 47590-0001; Description: USB-MICRO-AB, 47590-0001, SMT, MOLEX; Ref St: xxxxxxx; ECCN_US/EU: n/a; Distrib: *
D9 = DIODE SCHOTTKY: Schottky Diode; Dostawca: TME; Dostawca.Symbol: CRS14
R90 R91 = RES3

## Sheet I2C.SchDoc
size A4
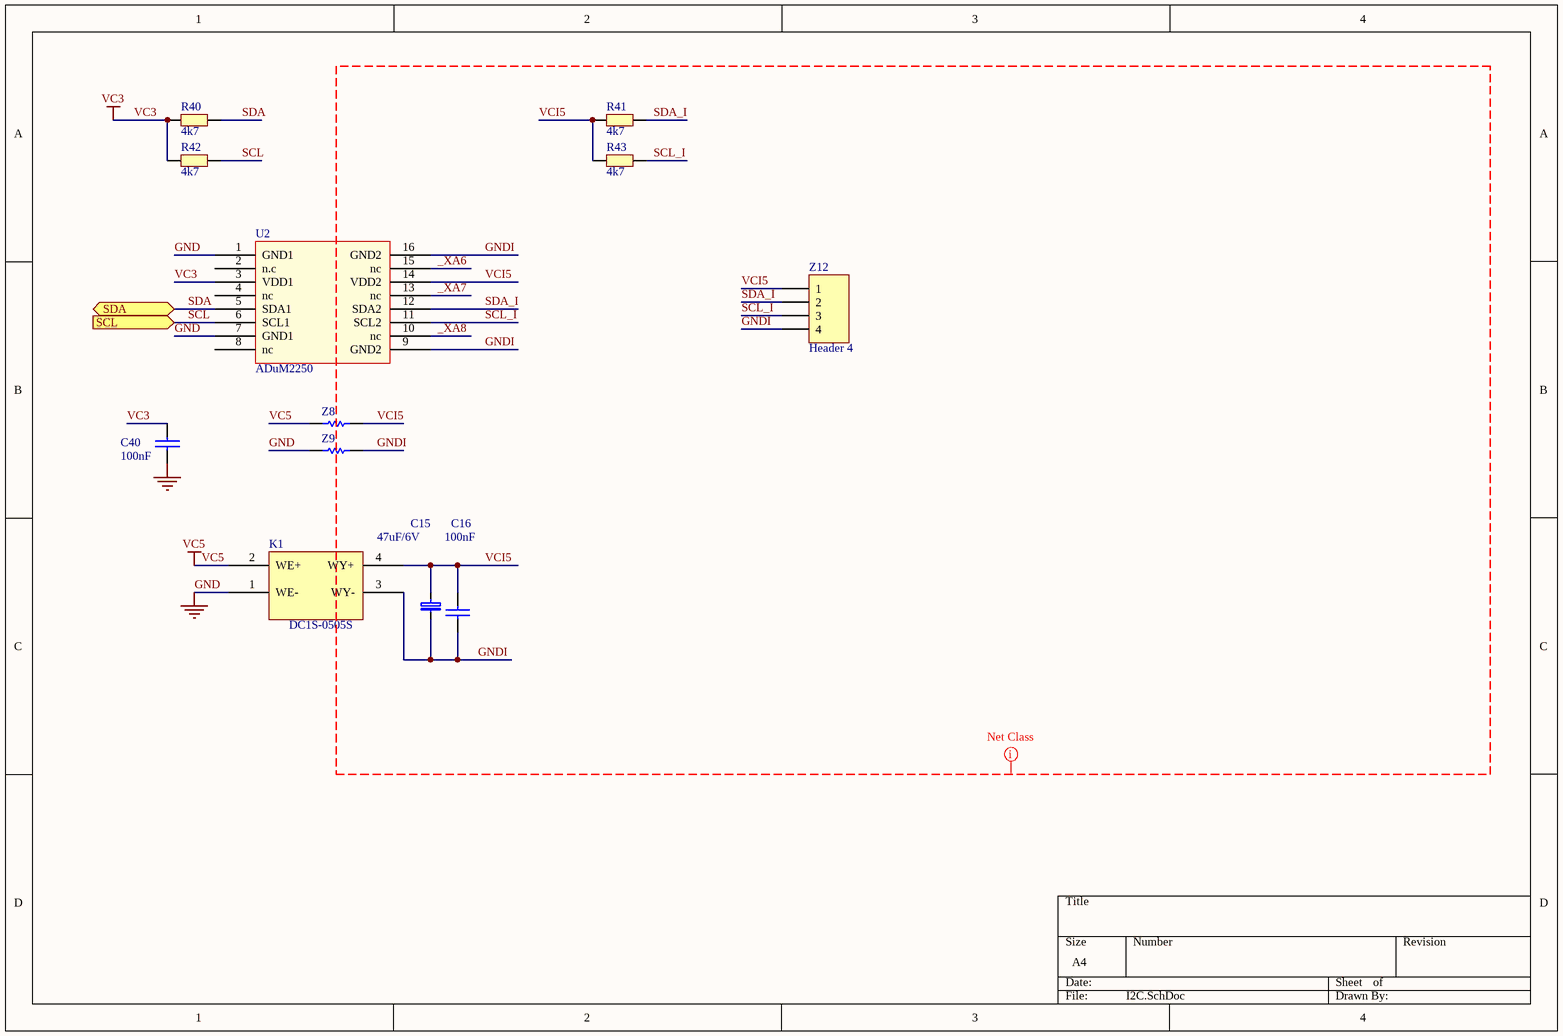
[diagram p6: I2C.SchDoc]

### Parts
C15  47uF/6V  [CAP_C]
C16  100nF  [0805C]
C40  100nF  [0805C]
K1  DC1S-0505S  [DCDC_SIL4]
R40  4k7  [0805R]
R41  4k7  [0805R]
R42  4k7  [0805R]
R43  4k7  [0805R]
U2  ADuM2250  [SMD16B]
Z8  0R  [1206R]  (value not drawn)
Z9  0R  [1206R]  (value not drawn)
Z12  Header 4  [ARC-L-4-3.5]

### Ports
SCL (in), SDA (bidir)

### Nets
GND: C40.1 K1.1(WE-) U2.1(GND1) U2.7(GND1) Z9.1
VC3: C40.2 R40.1 R42.1 U2.3(VDD1)
VC5: K1.2(WE+) Z8.1
_XA6: U2.15(nc)
_XA7: U2.13(nc)
_XA8: U2.10(nc)
GNDI: C15.1 C16.1 K1.3(WY-) U2.9(GND2) U2.16(GND2) Z9.2 Z12.4
SCL: R42.2 U2.6(SCL1) ; port SCL
SCL_I: R43.2 U2.11(SCL2) Z12.3
SDA: R40.2 U2.5(SDA1) ; port SDA
SDA_I: R41.2 U2.12(SDA2) Z12.2
VCI5: C15.2 C16.2 K1.4(WY+) R41.1 R43.1 U2.14(VDD2) Z8.2 Z12.1

Not connected (* = marked no-connect by the designer): U2 2(n.c) 4(nc) 8(nc)

### Layout directives
net class Class_4-20: _XA6, _XA7, _XA8, GNDI, SCL_I, SDA_I, VCI5

### Library data of the parts
C15 = CAP_TANTAL_SMD: as C35 on sheet Stabilizator
C16 C40 = ProE70.tmp_100n_4
K1 = DCDC_AM1S
R40-R43 = RES3
Z8 Z9 = Res Semi: Semiconductor Resistor; Value: 1K; Published: 8-Jun-2000; LatestRevisionDate: 17-Jul-2002; LatestRevisionNote: Re-released for DXP Platform.; PackageReference: AXIAL-0.5; Publisher: Altium Limited; PackageDescription: Axial Device, Thru-Hole; 2 Leads; 0.5 in Pin Spacing
Z12 = Header 4: Header, 4-Pin; LatestRevisionDate: 17-Jul-2002; LatestRevisionNote: Re-released for DXP Platform.; Publisher: Altium Limited

## Sheet SLED.SchDoc
size A4
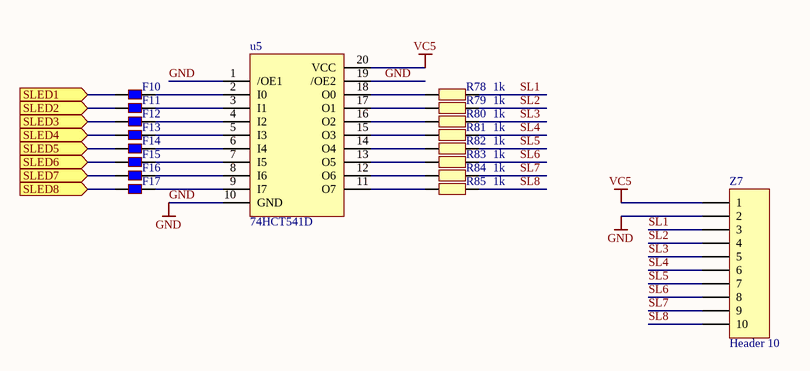
[diagram p7: SLED.SchDoc]

### Parts
F10  BLM18BB141SN1D  [0805L]  (value not drawn)
F11  BLM18BB141SN1D  [0805L]  (value not drawn)
F12  BLM18BB141SN1D  [0805L]  (value not drawn)
F13  BLM18BB141SN1D  [0805L]  (value not drawn)
F14  BLM18BB141SN1D  [0805L]  (value not drawn)
F15  BLM18BB141SN1D  [0805L]  (value not drawn)
F16  BLM18BB141SN1D  [0805L]  (value not drawn)
F17  BLM18BB141SN1D  [0805L]  (value not drawn)
R78  1k  [0805R]
R79  1k  [0805R]
R80  1k  [0805R]
R81  1k  [0805R]
R82  1k  [0805R]
R83  1k  [0805R]
R84  1k  [0805R]
R85  1k  [0805R]
u5  74HCT541D  [SMD20]
Z7  Header 10  [ARC-L-10-3.5]

### Ports
SLED1 (in), SLED2 (in), SLED3 (in), SLED4 (in), SLED5 (in), SLED6 (in), SLED7 (in), SLED8 (in)

### Nets
GND: u5.1(/OE1) u5.10(GND) u5.19(/OE2) Z7.2
VC5: u5.20(VCC) Z7.1
SL1: R78.2 Z7.3
SL2: R79.2 Z7.4
SL3: R80.2 Z7.5
SL4: R81.2 Z7.6
SL5: R82.2 Z7.7
SL6: R83.2 Z7.8
SL7: R84.2 Z7.9
SL8: R85.2 Z7.10
SLED1: F10.2 ; port SLED1
SLED2: F11.2 ; port SLED2
SLED3: F12.2 ; port SLED3
SLED4: F13.2 ; port SLED4
SLED5: F14.2 ; port SLED5
SLED6: F15.2 ; port SLED6
SLED7: F16.2 ; port SLED7
SLED8: F17.2 ; port SLED8
NetF10_1: F10.1 u5.2(I0)
NetF11_1: F11.1 u5.3(I1)
NetF12_1: F12.1 u5.4(I2)
NetF13_1: F13.1 u5.5(I3)
NetF14_1: F14.1 u5.6(I4)
NetF15_1: F15.1 u5.7(I5)
NetF16_1: F16.1 u5.8(I6)
NetF17_1: F17.1 u5.9(I7)
NetR78_1: R78.1 u5.18(O0)
NetR79_1: R79.1 u5.17(O1)
NetR80_1: R80.1 u5.16(O2)
NetR81_1: R81.1 u5.15(O3)
NetR82_1: R82.1 u5.14(O4)
NetR83_1: R83.1 u5.13(O5)
NetR84_1: R84.1 u5.12(O6)
NetR85_1: R85.1 u5.11(O7)

### Library data of the parts
F10-F17 = KORALIK: Koralik ferrytowy
R78-R85 = RES3
u5 = 74541
Z7 = Header 10: Header, 10-Pin; LatestRevisionDate: 17-Jul-2002; LatestRevisionNote: Re-released for DXP Platform.; Publisher: Altium Limited

## Sheet RS485.SchDoc
size A4
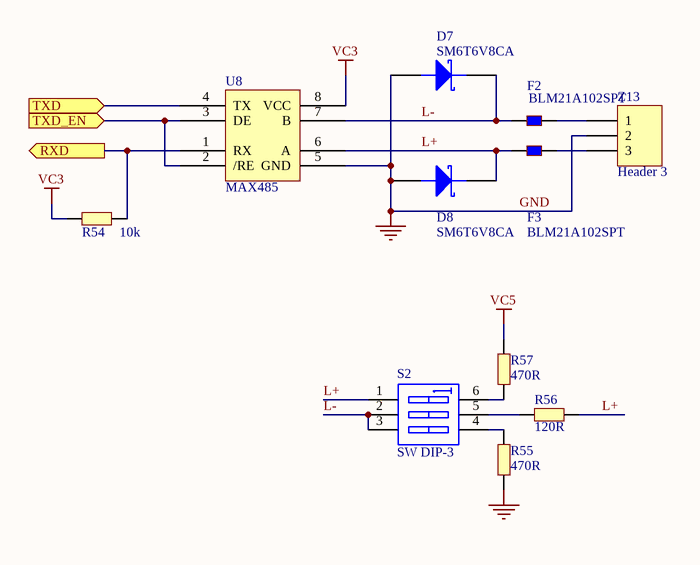
[diagram p8: RS485.SchDoc]

### Parts
D7  SM6T6V8CA  [RD5_U]
D8  SM6T6V8CA  [RD5_U]
F2  BLM21A102SPT  [0805]
F3  BLM21A102SPT  [0805]
R54  10k  [0805R]
R55  470R  [1206]
R56  120R  [1206]
R57  470R  [1206]
S2  SW DIP-3  [DIP-6]
U8  MAX485  [SO8]
Z13  Header 3  [ARC-L-3-3.5]

### Ports
RXD (out), TXD (in), TXD_EN (in)

### Nets
GND: D7.A D8.A R55.2 U8.5(GND) Z13.2
VC3: R54.1 U8.8(VCC)
VC5: R57.2
L+: D8.K F3.1 R56.2 S2.1(A1) U8.6(A)
L-: D7.K F2.1 S2.2(A2) S2.3(A3) U8.7(B)
R_RXD: R54.2 U8.1(RX) ; port RXD
R_TXD: U8.4(TX) ; port TXD
R_TXD_EN: U8.2(/RE) U8.3(DE) ; port TXD_EN
NetF2_2: F2.2 Z13.1
NetF3_2: F3.2 Z13.3
NetR55_1: R55.1 S2.4(B3)
NetR56_1: R56.1 S2.5(B2)
NetR57_1: R57.1 S2.6(B1)

### Library data of the parts
D7 D8 = DIODE SCHOTTKY: Schottky Diode
F2 F3 = KORALIK: Koralik ferrytowy
R54-R57 = RES3
S2 = SW DIP-3: DIP Switch, 3 Position, SPST; Published: 24-Mar-1999; LatestRevisionDate: 17-Jul-2002; LatestRevisionNote: Re-released for DXP Platform.; PackageReference: DIP-6; Publisher: Altium Limited; Code_JEDEC: MO-001-AM
U8 = MAX485_1
Z13 = Header 3: Header, 3-Pin; LatestRevisionDate: 17-Jul-2002; LatestRevisionNote: Re-released for DXP Platform.; Publisher: Altium Limited

## Nets that join several sheets
AGND: OnkoMain (C17.2 C18.2 R92.1 U1.20), Analogs (20 pins)
GND: OnkoMain (31 pins), Stabilizator (15 pins), Relays (U4.9), Ethernet (18 pins), USB (CN1.5 CN1.6 R91.2 T2.2), I2C (5 pins), SLED (u5.1 u5.10 u5.19 Z7.2), RS485 (5 pins)
VC3: OnkoMain (26 pins), Analogs (5 pins), Stabilizator (C37.2 U7.2), Relays (12 pins), Ethernet (17 pins), USB (T2.5), I2C (C40.2 R40.1 R42.1 U2.3), RS485 (R54.1 U8.8)
VC5: OnkoMain (BZ1.1), Stabilizator (5 pins), USB (D9.K), I2C (K1.2 Z8.1), SLED (u5.20 Z7.1), RS485 (R57.2)
VC24: OnkoMain (B1.CB), Analogs (Z2.3 Z3.3 Z4.3), Stabilizator (D10.A), Relays (13 pins)
ADC1: OnkoMain (U1.31), Analogs (C1.1 R2.1)
ADC2: OnkoMain (U1.30), Analogs (C2.1 R6.1)
ADC3: OnkoMain (U1.29), Analogs (C3.1 R10.1)
ADC4: OnkoMain (U1.36), Analogs (C4.1 R14.1)
ADC5: OnkoMain (U1.35), Analogs (C5.1 R18.1)
E_CRS_DV: OnkoMain (U1.32), Ethernet (R33.1)
E_MDC: OnkoMain (U1.16), Ethernet (U3.13)
E_MDIO: OnkoMain (U1.25), Ethernet (R23.1 U3.12)
E_OSC: OnkoMain (U1.67), Ethernet (R36.1)
E_REF_CLK: OnkoMain (U1.24), Ethernet (R26.1 U3.14)
E_RST: OnkoMain (U1.8), Ethernet (U3.15)
E_RXD0: OnkoMain (U1.33), Ethernet (R30.1)
E_RXD1: OnkoMain (U1.34), Ethernet (R31.1)
E_TX_EN: OnkoMain (U1.48), Ethernet (U3.16)
E_TXD0: OnkoMain (U1.51), Ethernet (U3.17)
E_TXD1: OnkoMain (U1.52), Ethernet (U3.18)
PP1: OnkoMain (U1.3), Relays (R60.1 R72.2)
PP2: OnkoMain (U1.4), Relays (R62.1 R73.2)
PP3: OnkoMain (U1.5), Relays (R64.1 R74.2)
PP4: OnkoMain (U1.1), Relays (R66.1 R75.2)
PP5: OnkoMain (U1.98), Relays (R68.1 R76.2)
PP6: OnkoMain (U1.2), Relays (R70.1 R77.2)
R_RXD: OnkoMain (U1.87), RS485 (R54.2 U8.1)
R_TXD: OnkoMain (U1.86), RS485 (U8.4)
R_TXD_EN: OnkoMain (U1.85), RS485 (U8.2 U8.3)
SCL: OnkoMain (F8.2 R58.1 U1.92), I2C (R42.2 U2.6)
SDA: OnkoMain (F9.2 R59.1 U1.93), I2C (R40.2 U2.5)
SLED1: OnkoMain (U1.81), SLED (F10.2)
SLED2: OnkoMain (U1.82), SLED (F11.2)
SLED3: OnkoMain (U1.83), SLED (F12.2)
SLED4: OnkoMain (U1.84), SLED (F13.2)
SLED5: OnkoMain (U1.77), SLED (F14.2)
SLED6: OnkoMain (U1.78), SLED (F15.2)
SLED7: OnkoMain (U1.79), SLED (F16.2)
SLED8: OnkoMain (U1.80), SLED (F17.2)
USB_DN: OnkoMain (U1.70), USB (T2.3)
USB_DP: OnkoMain (U1.71), USB (T2.1)
USB_VBUS: OnkoMain (U1.69), USB (R90.2 R91.1)